# Altium schematic sheet pin_conditiong.SchDoc
size A4
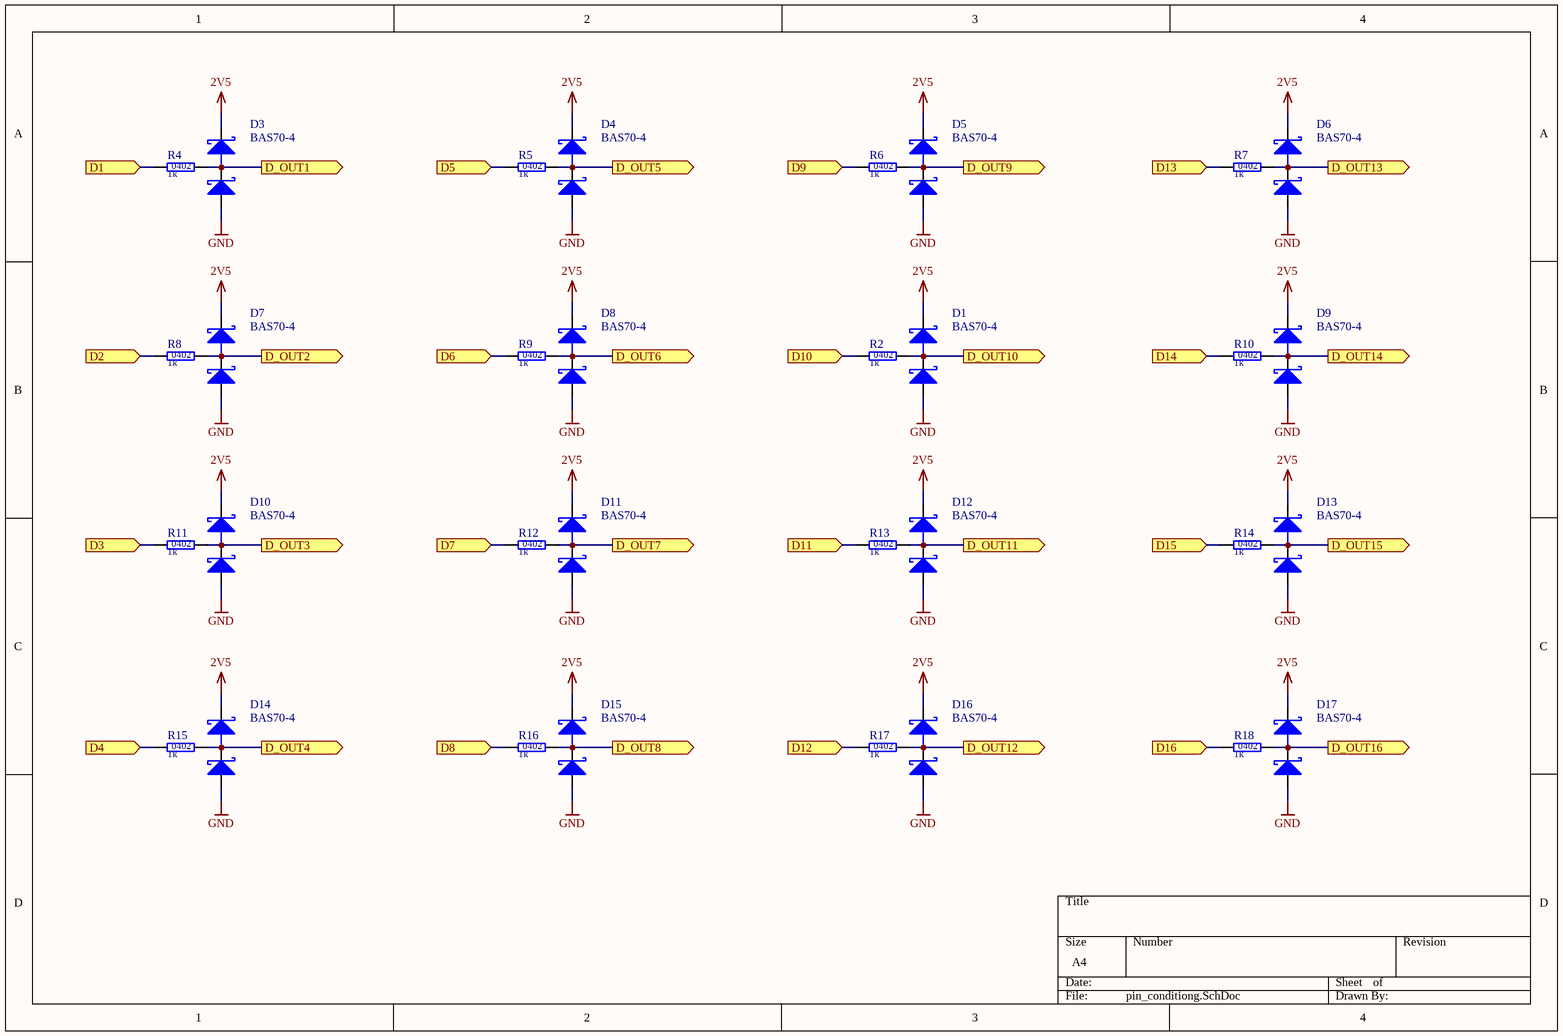
[diagram p0: pin_conditiong.SchDoc]

## Parts
D1  BAS70-4  [BAS70-4]
D3  BAS70-4  [BAS70-4]
D4  BAS70-4  [BAS70-4]
D5  BAS70-4  [BAS70-4]
D6  BAS70-4  [BAS70-4]
D7  BAS70-4  [BAS70-4]
D8  BAS70-4  [BAS70-4]
D9  BAS70-4  [BAS70-4]
D10  BAS70-4  [BAS70-4]
D11  BAS70-4  [BAS70-4]
D12  BAS70-4  [BAS70-4]
D13  BAS70-4  [BAS70-4]
D14  BAS70-4  [BAS70-4]
D15  BAS70-4  [BAS70-4]
D16  BAS70-4  [BAS70-4]
D17  BAS70-4  [BAS70-4]
R2  value 1k  SCH_Footprint: 0402  [R_0402_1005]  (hidden comment: Resistor)
R4  value 1k  SCH_Footprint: 0402  [R_0402_1005]  (hidden comment: Resistor)
R5  value 1k  SCH_Footprint: 0402  [R_0402_1005]  (hidden comment: Resistor)
R6  value 1k  SCH_Footprint: 0402  [R_0402_1005]  (hidden comment: Resistor)
R7  value 1k  SCH_Footprint: 0402  [R_0402_1005]  (hidden comment: Resistor)
R8  value 1k  SCH_Footprint: 0402  [R_0402_1005]  (hidden comment: Resistor)
R9  value 1k  SCH_Footprint: 0402  [R_0402_1005]  (hidden comment: Resistor)
R10  value 1k  SCH_Footprint: 0402  [R_0402_1005]  (hidden comment: Resistor)
R11  value 1k  SCH_Footprint: 0402  [R_0402_1005]  (hidden comment: Resistor)
R12  value 1k  SCH_Footprint: 0402  [R_0402_1005]  (hidden comment: Resistor)
R13  value 1k  SCH_Footprint: 0402  [R_0402_1005]  (hidden comment: Resistor)
R14  value 1k  SCH_Footprint: 0402  [R_0402_1005]  (hidden comment: Resistor)
R15  value 1k  SCH_Footprint: 0402  [R_0402_1005]  (hidden comment: Resistor)
R16  value 1k  SCH_Footprint: 0402  [R_0402_1005]  (hidden comment: Resistor)
R17  value 1k  SCH_Footprint: 0402  [R_0402_1005]  (hidden comment: Resistor)
R18  value 1k  SCH_Footprint: 0402  [R_0402_1005]  (hidden comment: Resistor)

## Ports
D1 (in), D2 (in), D3 (in), D4 (in), D5 (in), D6 (in), D7 (in), D8 (in), D9 (in), D10 (in), D11 (in), D12 (in), D13 (in), D14 (in), D15 (in), D16 (in), D_OUT1 (out), D_OUT2 (out), D_OUT3 (out), D_OUT4 (out), D_OUT5 (out), D_OUT6 (out), D_OUT7 (out), D_OUT8 (out), D_OUT9 (out), D_OUT10 (out), D_OUT11 (out), D_OUT12 (out), D_OUT13 (out), D_OUT14 (out), D_OUT15 (out), D_OUT16 (out)

## Nets
2V5: D1.2(VCC) D3.2(VCC) D4.2(VCC) D5.2(VCC) D6.2(VCC) D7.2(VCC) D8.2(VCC) D9.2(VCC) D10.2(VCC) D11.2(VCC) D12.2(VCC) D13.2(VCC) D14.2(VCC) D15.2(VCC) D16.2(VCC) D17.2(VCC)
GND: D1.1(GND) D3.1(GND) D4.1(GND) D5.1(GND) D6.1(GND) D7.1(GND) D8.1(GND) D9.1(GND) D10.1(GND) D11.1(GND) D12.1(GND) D13.1(GND) D14.1(GND) D15.1(GND) D16.1(GND) D17.1(GND)
D1: R4.1 ; port D1
D2: R8.1 ; port D2
D3: R11.1 ; port D3
D4: R15.1 ; port D4
D5: R5.1 ; port D5
D6: R9.1 ; port D6
D7: R12.1 ; port D7
D8: R16.1 ; port D8
D9: R6.1 ; port D9
D10: R2.1 ; port D10
D11: R13.1 ; port D11
D12: R17.1 ; port D12
D13: R7.1 ; port D13
D14: R10.1 ; port D14
D15: R14.1 ; port D15
D16: R18.1 ; port D16
D_OUT1: D3.3(SIG) R4.2 ; port D_OUT1
D_OUT2: D7.3(SIG) R8.2 ; port D_OUT2
D_OUT3: D10.3(SIG) R11.2 ; port D_OUT3
D_OUT4: D14.3(SIG) R15.2 ; port D_OUT4
D_OUT5: D4.3(SIG) R5.2 ; port D_OUT5
D_OUT6: D8.3(SIG) R9.2 ; port D_OUT6
D_OUT7: D11.3(SIG) R12.2 ; port D_OUT7
D_OUT8: D15.3(SIG) R16.2 ; port D_OUT8
D_OUT9: D5.3(SIG) R6.2 ; port D_OUT9
D_OUT10: D1.3(SIG) R2.2 ; port D_OUT10
D_OUT11: D12.3(SIG) R13.2 ; port D_OUT11
D_OUT12: D16.3(SIG) R17.2 ; port D_OUT12
D_OUT13: D6.3(SIG) R7.2 ; port D_OUT13
D_OUT14: D9.3(SIG) R10.2 ; port D_OUT14
D_OUT15: D13.3(SIG) R14.2 ; port D_OUT15
D_OUT16: D17.3(SIG) R18.2 ; port D_OUT16

## Library data of the parts
D1 D3-D17 = BAS70-4: Dioda: prostownicza Schottky; SMD; 70V; 70mA; 5ns; SOT23; 200mW
R2 R4-R18 = R_1k_0402_1: Manufacturer: Yageo; Manufacturer Part Number: RC0402FR-071K; Voltage: 50V; Power: 63mW; Tolerance: 1%; Part Number: R_1k_0402_1; HelpURL: http://www.tme.eu/pl/Document/1a2bc76e2be68b3b1670068306778ce6/rc0402yageo.pdf; Supplier 1: TME; Supplier Part Number 1: RC0402FR-071K; Supplier 2: RS Components; Supplier 3: Farnell; Supplier Part Number 3: 9239235; Supplier 4: Mouser; Supplier Part Number 4: 603-RC0402FR-071KP; Supplier 5: Digi-Key; Supplier Part Number 5: 311-1.00KLRCT-ND